# EAGLE design nRF52833_MCU (EAGLE 9.6.2)
Contributed by Nordic Semiconductor Product Page here <http://infocenter.nordicsemi.com/index.jsp?topic=%2Fcom.nordic.infocenter.nrf52832.ps.v1.1%2Fref_circuitry.html> Disclaimer: For the most up to date reference layout see the infocenter at nordicsemi.com Description: Bluetooth Low Energy board

## Sheet 1 of 2
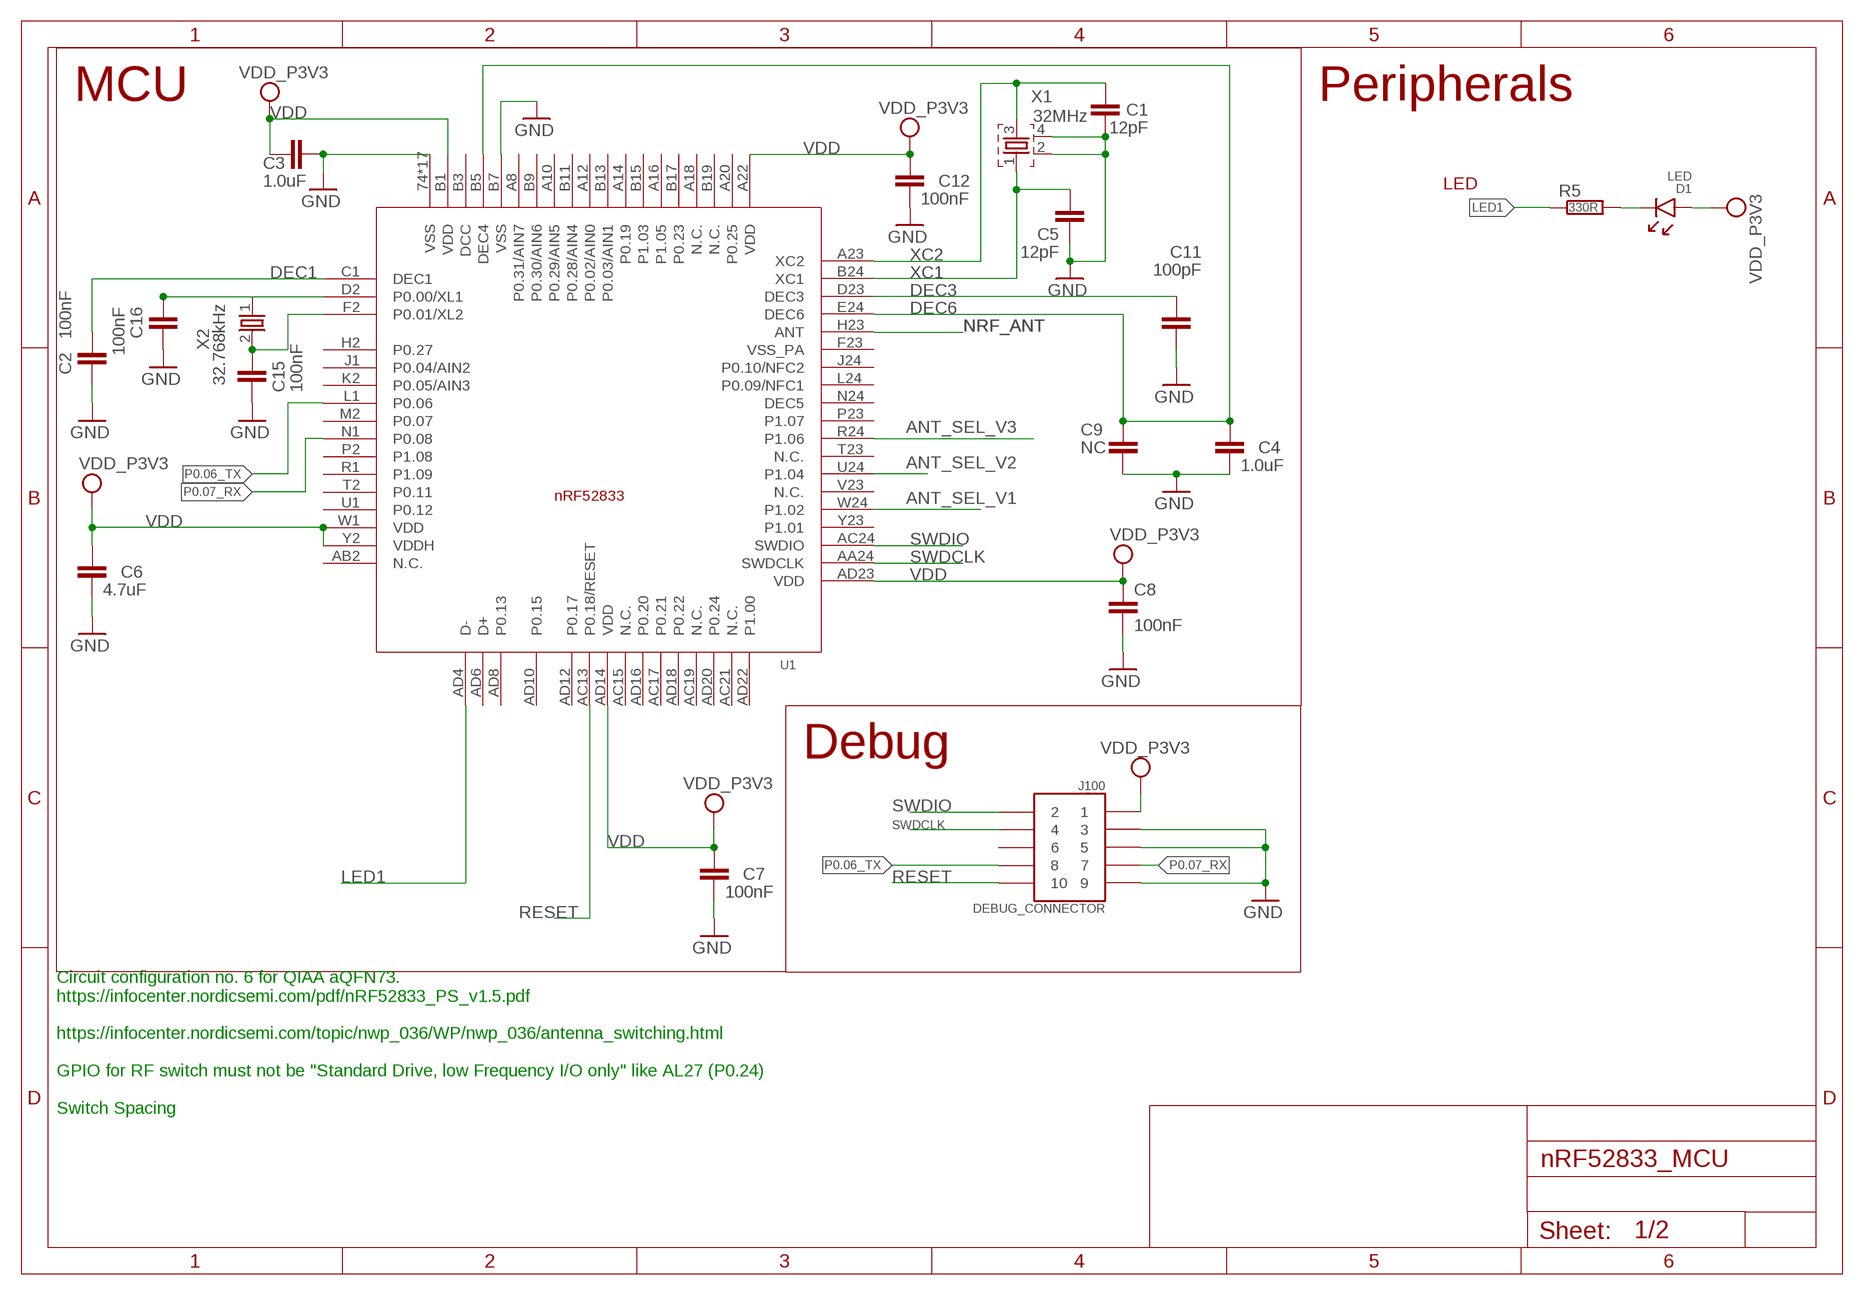
[diagram p0: schematic, sheet 1]

### Parts
C1  12pF  CAPACITOR_0402_N  [RESC0402_N]
C2  100nF  CAPACITOR_0402_N  [RESC0402_N]
C3  1.0uF  CAPACITOR_0402_N  [RESC0402_N]
C4  1.0uF  CAPACITOR_0402_N  [RESC0402_N]
C5  12pF  CAPACITOR_0402_N  [RESC0402_N]
C6  4.7uF  CAPACITOR_0402_N  [RESC0402_N]
C7  100nF  CAPACITOR_0402_N  [RESC0402_N]
C8  100nF  CAPACITOR_0402_N  [RESC0402_N]
C9  NC  CAPACITOR_0402_N  [RESC0402_N]
C11  100pF  CAPACITOR_0402_N  [RESC0402_N]
C12  100nF  CAPACITOR_0402_N  [RESC0402_N]
C15  100nF  CAPACITOR_0402_N  [RESC0402_N]
C16  100nF  CAPACITOR_0402_N  [RESC0402_N]
D1  LED  [DIOC0603_N]
J100  DEBUG_CONNECTOR  [HDRV127P5X2-10_N]
R5  330R  RESISTOR_0402_N  [RESC0402_N]
U1  nRF52833-QIAA  NRF52833_QIAANRF52833_QIAA_AQFN50P700X700X85_HS-74N  [AQFN50P700X700X85_HS-74N]
X1  32MHz  XTAL_32MHZ  [BT-XTAL_2016_N]
X2  32.768kHz  XTAL_32KHZ  [XTAL_3215_N]

### Nets
ANT_SEL_V1: U1.W24(P1.02) ; also sheet 2
ANT_SEL_V2: U1.U24(P1.04) ; also sheet 2
ANT_SEL_V3: U1.R24(P1.06) ; also sheet 2
DEC1: C2.1 U1.C1(DEC1)
DEC3: C11.1 U1.D23(DEC3)
DEC6: C4.1 C9.1 U1.B5(DEC4) U1.E24(DEC6)
GND: C1.2 C2.2 C3.2 C4.2 C5.2 C6.2 C7.2 C8.2 C9.2 C11.2 C12.2 C15.1 C16.1 J100.3 J100.5 J100.9 U1.74(VSS) U1.B7(VSS) U1.P$1(VSS) U1.P$2(VSS) U1.P$3(VSS) U1.P$4(VSS) U1.P$5(VSS) U1.P$10(VSS) U1.P$11(VSS) U1.P$12(VSS) U1.P$13(VSS) U1.P$14(VSS) U1.P$15(VSS) U1.P$16(VSS) U1.P$17(VSS) U1.P$18(VSS) U1.P$19(VSS) U1.P$20(VSS) X1.2 X1.4 ; also sheet 2
LED1: R5.1 U1.AD4(D-)
N$2: C16.2 U1.D2(P0.00/XL1) X2.1
N$3: C15.2 U1.F2(P0.01/XL2) X2.2
N$8: D1.1(C) R5.2
NRF_ANT: U1.H23(ANT) ; also sheet 2
P0.06_TX: J100.8 U1.L1(P0.06)
P0.07_RX: J100.7 U1.N1(P0.08)
RESET: J100.10 U1.AC13(P0.18/RESET)
SWDCLK: J100.4 U1.AA24(SWDCLK)
SWDIO: J100.2 U1.AC24(SWDIO)
VDD: C3.1 C6.1 C7.1 C8.1 C12.1 D1.2(A) J100.1 U1.A22(VDD) U1.AD14(VDD) U1.AD23(VDD) U1.B1(VDD) U1.W1(VDD) U1.Y2(VDDH) ; supply symbol labelled VDD_P3V3 ; also sheet 2
XC1: C5.1 U1.B24(XC1) X1.1
XC2: C1.1 U1.A23(XC2) X1.3
Unconnected: J100.6 U1.A8(P0.31/AIN7) U1.A10(P0.29/AIN5) U1.A12(P0.02/AIN0) U1.A14(P0.19) U1.A16(P1.05) U1.A18(N.C.) U1.A20(P0.25) U1.AB2(N.C.) U1.AC15(N.C.) U1.AC17(P0.21) U1.AC19(N.C.) U1.AC21(N.C.) U1.AD6(D+) U1.AD8(P0.13) U1.AD10(P0.15) U1.AD12(P0.17) U1.AD16(P0.20) U1.AD18(P0.22) U1.AD20(P0.24) U1.AD22(P1.00) U1.B3(DCC) U1.B9(P0.30/AIN6) U1.B11(P0.28/AIN4) U1.B13(P0.03/AIN1) U1.B15(P1.03) U1.B17(P0.23) U1.B19(N.C.) U1.H2(P0.27) U1.J1(P0.04/AIN2) U1.J24(P0.10/NFC2) U1.K2(P0.05/AIN3) U1.L24(P0.09/NFC1) U1.M2(P0.07) U1.P2(P1.08) U1.P23(P1.07) U1.R1(P1.09) U1.T2(P0.11) U1.T23(N.C.) U1.U1(P0.12) U1.V23(N.C.) U1.Y23(P1.01)

### Notes on the sheet
- MCU | Peripherals
- LED
- Debug
- Circuit configuration no. 6 for QIAA aQFN73.
  https://infocenter.nordicsemi.com/pdf/nRF52833_PS_v1.5.pdf
  
  https://infocenter.nordicsemi.com/topic/nwp_036/WP/nwp_036/antenna_switching.html
  
  GPIO for RF switch must not be "Standard Drive, low Frequency I/O only" like AL27 (P0.24)
  
  Switch Spacing

## Sheet 2 of 2
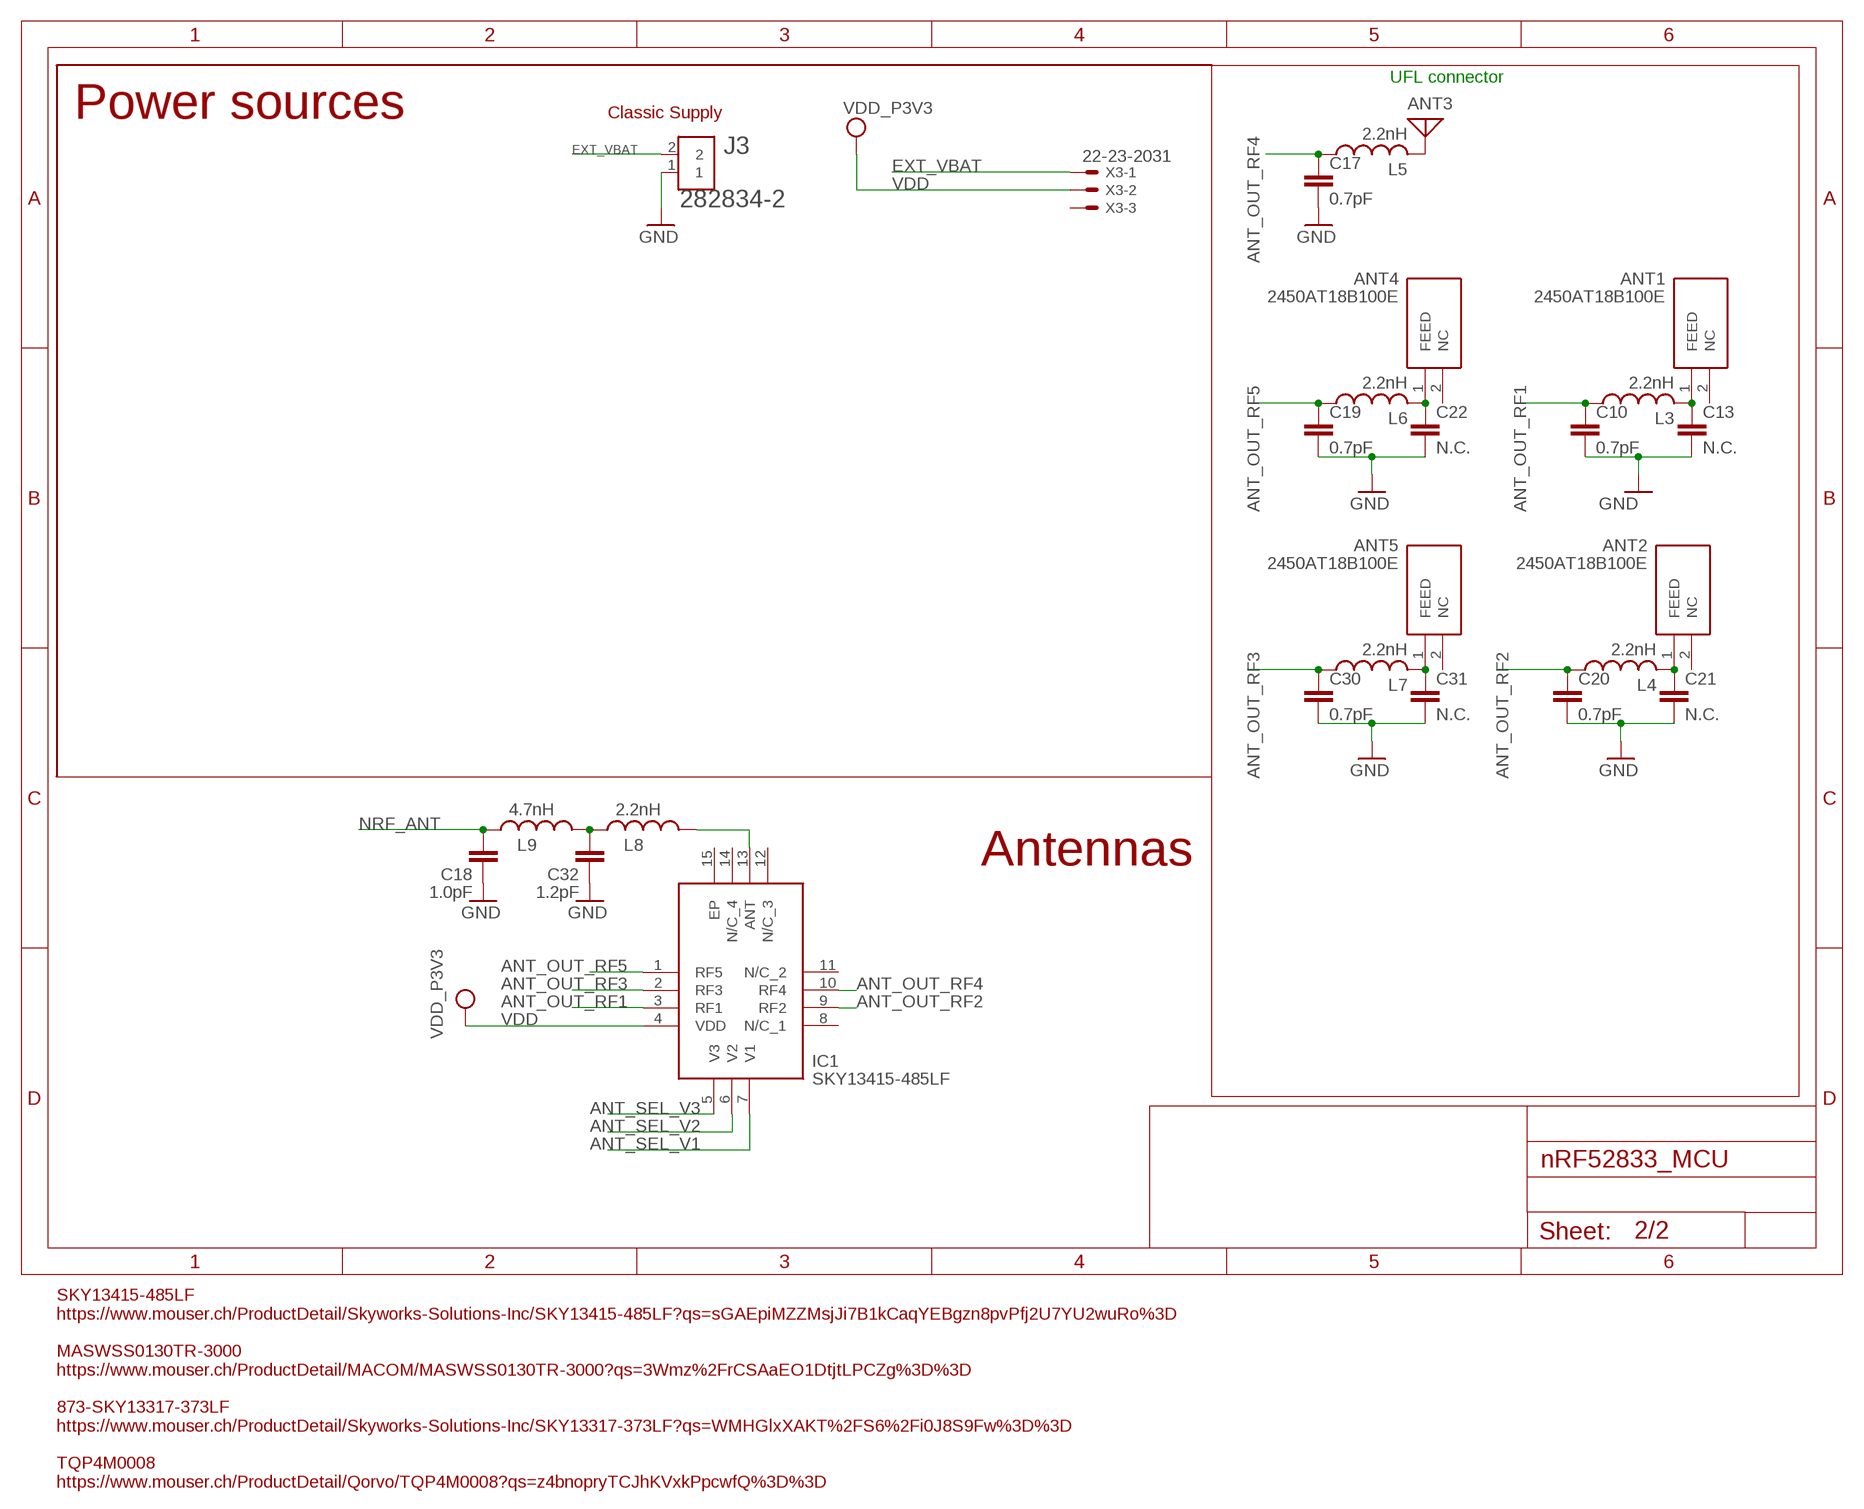
[diagram p1: schematic, sheet 2]

### Parts
ANT1  2450AT18B100E  [ANTC3216X140N]
ANT2  2450AT18B100E  [ANTC3216X140N]
ANT3  ANTENNA  [PAD-01]
ANT4  2450AT18B100E  [ANTC3216X140N]
ANT5  2450AT18B100E  [ANTC3216X140N]
C10  0.7pF  CAPACITOR_0402_N  [RESC0402_N]
C13  N.C.  CAPACITOR_0402_N  [RESC0402_N]
C17  0.7pF  CAPACITOR_0402_N  [RESC0402_N]
C18  1.0pF  CAPACITOR_0402_N  [RESC0402_N]
C19  0.7pF  CAPACITOR_0402_N  [RESC0402_N]
C20  0.7pF  CAPACITOR_0402_N  [RESC0402_N]
C21  N.C.  CAPACITOR_0402_N  [RESC0402_N]
C22  N.C.  CAPACITOR_0402_N  [RESC0402_N]
C30  0.7pF  CAPACITOR_0402_N  [RESC0402_N]
C31  N.C.  CAPACITOR_0402_N  [RESC0402_N]
C32  1.2pF  CAPACITOR_0402_N  [RESC0402_N]
IC1  SKY13415-485LF  [SKY13415485LF]
J3  282834-2  [CONN_282834-2]
L3  2.2nH  INDUCTOR_0402_N  [RESC0402_N]
L4  2.2nH  INDUCTOR_0402_N  [RESC0402_N]
L5  2.2nH  INDUCTOR_0402_N  [RESC0402_N]
L6  2.2nH  INDUCTOR_0402_N  [RESC0402_N]
L7  2.2nH  INDUCTOR_0402_N  [RESC0402_N]
L8  2.2nH  INDUCTOR_0402_N  [RESC0402_N]
L9  4.7nH  INDUCTOR_0402_N  [RESC0402_N]
X3  22-23-2031  [22-23-2031]

### Nets
ANT_OUT_RF1: C10.1 IC1.3(RF1) L3.1
ANT_OUT_RF2: C20.1 IC1.9(RF2) L4.1
ANT_OUT_RF3: C30.1 IC1.2(RF3) L7.1
ANT_OUT_RF4: C17.1 IC1.10(RF4) L5.1
ANT_OUT_RF5: C19.1 IC1.1(RF5) L6.1
ANT_SEL_V1: IC1.7(V1) ; also sheet 1
ANT_SEL_V2: IC1.6(V2) ; also sheet 1
ANT_SEL_V3: IC1.5(V3) ; also sheet 1
EXT_VBAT: J3.2 X3.1
GND: C10.2 C13.2 C17.2 C18.2 C19.2 C20.2 C21.2 C22.2 C30.2 C31.2 C32.2 J3.1 ; also sheet 1
N$5: ANT1.1(FEED) C13.1 L3.2
N$12: ANT3.1 L5.2
N$13: ANT4.1(FEED) C22.1 L6.2
N$14: ANT5.1(FEED) C31.1 L7.2
N$22: IC1.13(ANT) L8.2
N$23: C32.1 L8.1 L9.2
N$40: ANT2.1(FEED) C21.1 L4.2
NRF_ANT: C18.1 L9.1 ; also sheet 1
VDD: IC1.4(VDD) X3.2 ; supply symbol labelled VDD_P3V3 ; also sheet 1
Unconnected: ANT1.2(NC) ANT2.2(NC) ANT4.2(NC) ANT5.2(NC) IC1.8(N/C_1) IC1.11(N/C_2) IC1.12(N/C_3) IC1.14(N/C_4) IC1.15(EP) X3.3

### Notes on the sheet
- UFL connector
- Power sources | Classic Supply
- Antennas
- SKY13415-485LF
  https://www.mouser.ch/ProductDetail/Skyworks-Solutions-Inc/SKY13415-485LF?qs=sGAEpiMZZMsjJi7B1kCaqYEBgzn8pvPfj2U7YU2wuRo%3D
  
  MASWSS0130TR-3000
  https://www.mouser.ch/ProductDetail/MACOM/MASWSS0130TR-3000?qs=3Wmz%2FrCSAaEO1DtjtLPCZg%3D%3D
  
  873-SKY13317-373LF
  https://www.mouser.ch/ProductDetail/Skyworks-Solutions-Inc/SKY13317-373LF?qs=WMHGlxXAKT%2FS6%2Fi0J8S9Fw%3D%3D
  
  TQP4M0008
  https://www.mouser.ch/ProductDetail/Qorvo/TQP4M0008?qs=z4bnopryTCJhKVxkPpcwfQ%3D%3D

## Power pins joined to a net without a drawn wire
DEC5: U1.N24(DEC5)
VSS_PA: U1.F23(VSS_PA)

## Library data of the parts
ANT1 ANT2 ANT4 ANT5 = 2450AT18B100E:2450AT18B100E: Antennas 2.45GHz ANTENNA Source: Datasheet <https://www.johansontechnology.com/datasheets/2450AT18B100/2450AT18B100.pdf>; DESCRIPTION: Antennas 2.45GHz ANTENNA; HEIGHT: 1.4mm; MANUFACTURER_NAME: JOHANSON TECHNOLOGY; MANUFACTURER_PART_NUMBER: 2450AT18B100E; MOUSER_PART_NUMBER: 609-2450AT18B100E; MOUSER_PRICE-STOCK: https://www.mouser.co.uk/ProductDetail/Johanson-Technology/2450AT18B100E?qs=yCnrNFeXz%252Bh5MFsFIXGZGA%3D%3D
ANT3 = discrete:ANTENNA: Antenna
C1-C13 C15-C22 C30-C32 = Nordic_misc:CAPACITOR: Generic chip capacitor
D1 = Nordic_misc:LED
IC1 = SamacSys_Parts:SKY13415-485LF: RF Switch ICs 100-3000MHz SP5T IL .45dB Iso >31dB Source: Datasheet <https://datasheet.datasheetarchive.com/originals/distributors/DKDS-19/379227.pdf>; DESCRIPTION: RF Switch ICs 100-3000MHz SP5T IL .45dB Iso >31dB; HEIGHT: 0.65mm; MANUFACTURER_NAME: Skyworks; MANUFACTURER_PART_NUMBER: SKY13415-485LF; MOUSER_PART_NUMBER: 873-SKY13415-485LF; MOUSER_PRICE-STOCK: https://www.mouser.co.uk/ProductDetail/Skyworks-Solutions-Inc/SKY13415-485LF?qs=aD6bdfC8ElPZ66ZJrc0H4g%3D%3D
J3 = 282834-2:282834-2: Terminal block; 2.54mm; angled 90°; 0.03÷1mm2; ways: 2; 10A; H: 10mm; AVAILABILITY: Unavailable; CENTERLINE_PITCH: 2.54 mm[.1 in]; COMMENT: 282834-2; DESCRIPTION: TERMI-BLOK PCB MOUNT, 90 2P.; EU_ROHS_COMPLIANCE: Compliant with Exemptions; MF: TE Connectivity; MP: 282834-2; NUMBER_OF_POSITIONS: 2; PACKAGE: None; PRICE: None; TE_PURCHASE_URL: https://www.te.com/usa-en/product-282834-2.html?te_bu=Cor&te_type=disp&te_campaign=seda_glo_cor-seda-global-disp-prtnr-fy19-seda-model-bom-cta_sma-317_1&elqCampaignId=32493
J100 = Nordic_misc:DEBUG_CONNECTOR
L3-L9 = Nordic_misc:INDUCTOR: Generic chip inductor
R5 = Nordic_misc:RESISTOR: Generic chip resistor
U1 = nrf52833_qiaa:NRF52833_QIAA: Multi-protocol Bluetooth Low Energy, IEEE 802.15.4, ANT and 2.4GHz proprietary system-on-chip; FOOTPRINT_DOC: AQFN-73; LATESTREVISIONDATE: 2018-12-03; MANUFACTURER: Nordic Semiconductor; MANUFACTURER_PART_NUMBER: nRF52833-QIAA; NOTE: *; PART_NUMBER: nRF52833-QIAA; PIN_COUNT: 73; PUBLISHED: 2018-12-03; PUBLISHER: Nordic Semiconductor
X1 = Nordic_nRF:XTAL_32MHZ
X2 = Nordic_nRF:XTAL_32KHZ
X3 = con-molex:22-23-2031: .100" (2.54mm) Center Header - 3 Pin; MF: MOLEX; MPN: 22-23-2031; OC_FARNELL: 1462950; OC_NEWARK: 30C0862

## Net classes
0 default: clearance 0.205 mm

## Board
Contributed by Nordic Semiconductor Product Page here <http://infocenter.nordicsemi.com/index.jsp?topic=%2Fcom.nordic.infocenter.nrf52832.ps.v1.1%2Fref_circuitry.html> Disclaimer: For the most up to date reference layout see the infocenter at nordicsemi.com Description: Bluetooth Low Energy board
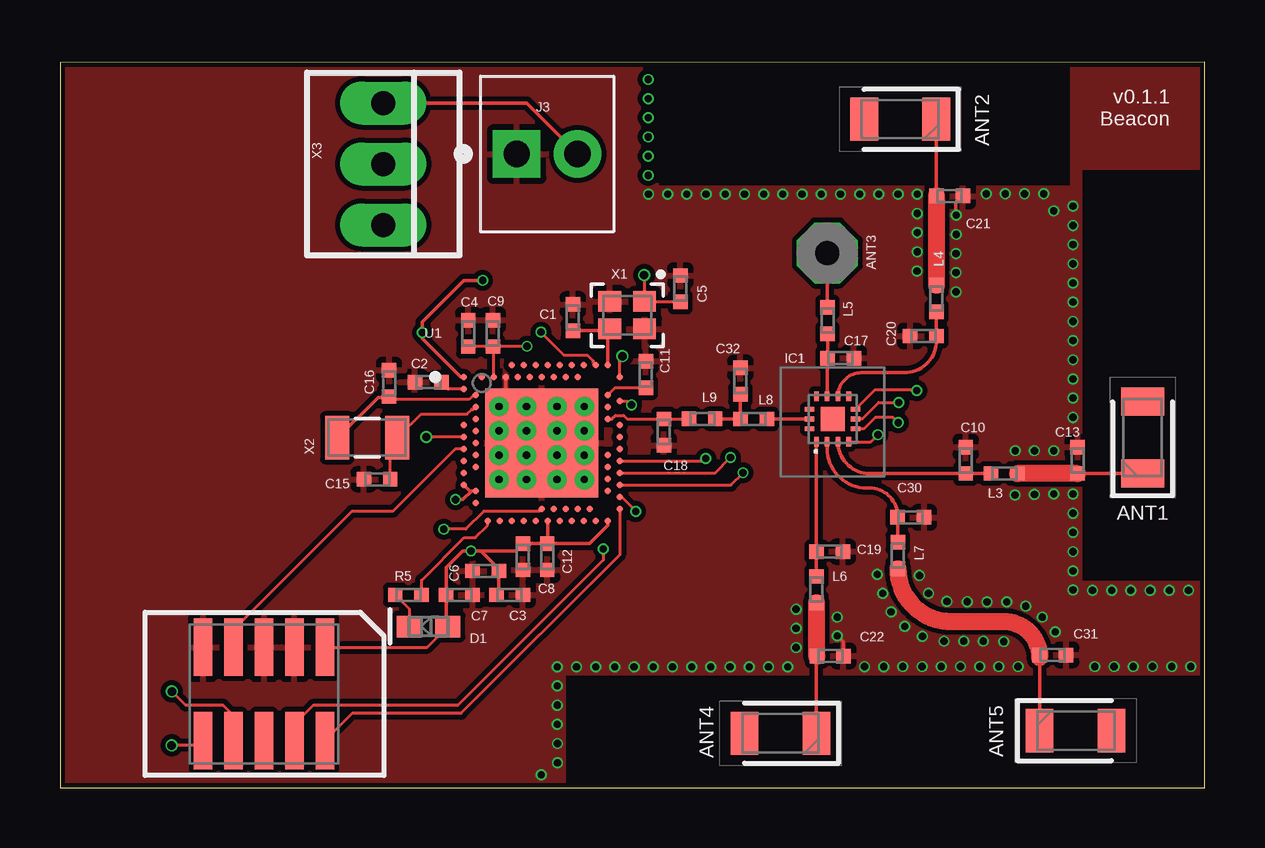
[diagram p2: board, top side]
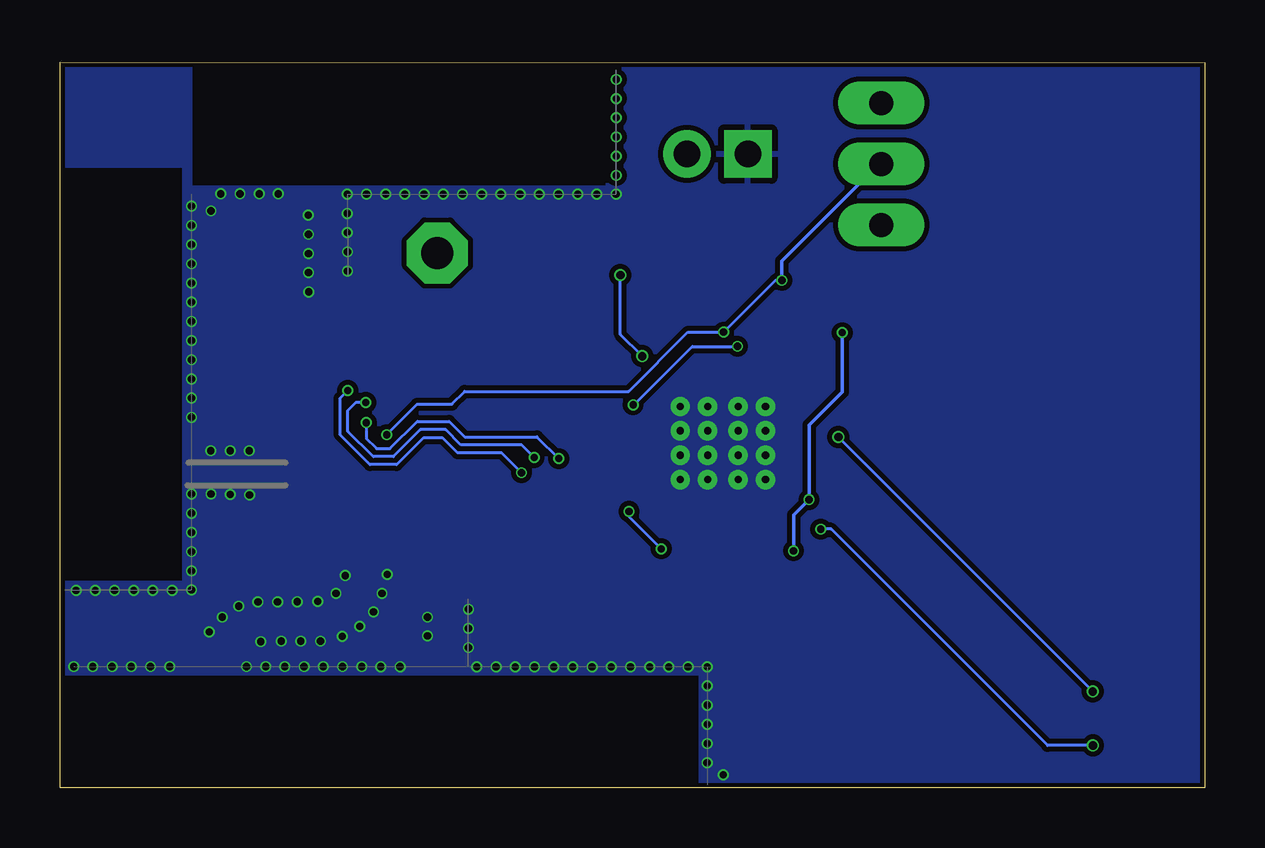
[diagram p3: board, bottom side, seen from below]

Size 47.69 x 30.24 mm. Coordinates in mm from the lower left corner, seen from the top.
Outline: 0,0 47.69,0 47.69,30.24 0,30.22 0,0
Copper layers (1*16): Top 0.035mm / dielectric 1.6mm / Bottom 0.035mm
Design rules "jlcpcb-2layers": minimum track width 5mil, minimum drill 0.3mm, track to track 5mil, track to pad 5mil, pad to pad 5mil, via to via 5mil, smd to smd 5mil, copper to edge 0.2mm, drill to drill 6mil, minimum pad ring 10mil, minimum via ring 3mil, stop-mask expansion 4mil, vias tented up to drill 0mil, thermal gap 10mil
tRestrict: area 42.6,8.6 to 47.6,25.7; area 25,25.1 to 42.1,30.1; area 21.1,-0.3 to 38.2,4.7; area 30.6,-0.3 to 47.7,4.7
bRestrict: area 42.6,8.6 to 47.6,25.8; area 25,25.1 to 42.2,30.1; area 30.5,-0.3 to 47.7,4.7; area 21.1,-0.3 to 38.3,4.7; area 21.1,-0.3 to 38.3,4.7

### Footprints (pad centres in the part's own frame; a part is rotated, then mirrored left to right if it is on the bottom)
ANTC3216X140N = smd 1.15 x 1.8: 1 -1.5,0; 2 1.5,0
PAD-01 = drill 1.321 pad 2.54 octagon: 1 0,0
RESC0402_N = smd 0.6 x 0.6: 1 -0.55,0; 2 0.55,0
DIOC0603_N = smd 1.05 x 0.9: 1 -0.8,0; 2 0.8,0
SKY13415485LF = smd 0.395 x 0.191: 1 -0.953,0.675; 2 -0.953,0.225; 3 -0.953,-0.225; 4 -0.953,-0.675; 8 0.953,-0.675; 9 0.953,-0.225; 10 0.953,0.225; 11 0.953,0.675 | smd 0.191 x 0.395: 5 -0.4,-0.953; 6 0,-0.953; 7 0.4,-0.953; 12 0.4,0.953; 13 0,0.953; 14 -0.4,0.953 | smd 1 x 1: 15 0,0
CONN_282834-2 = drill 1.1 square: 1 -1.27,0 | drill 1.1: 2 1.27,0
HDRV127P5X2-10_N = smd 0.76 x 2.4: 1 -2.54,-1.95; 2 -2.54,1.95; 3 -1.27,-1.95; 4 -1.27,1.95; 5 0,-1.95; 6 0,1.95; 7 1.27,-1.95; 8 1.27,1.95; 9 2.54,-1.95; 10 2.54,1.95
AQFN50P700X700X85_HS-74N = smd 4.699 x 4.547: 74 0,0 | smd 0.275 x 0.275: A8 -1.25,3.25; A10 -0.75,3.25; A12 -0.25,3.25; A14 0.25,3.25; A16 0.75,3.25; A18 1.25,3.25; A20 1.75,3.25; A22 2.25,3.25; A23 2.75,3.25; AA24 3.25,-2.25; AB2 -2.75,-2.5; AC13 0,-2.75; AC15 0.5,-2.75; AC17 1,-2.75; AC19 1.5,-2.75; AC21 2,-2.75; AC24 3.25,-2.75; AD4 -2.25,-3.25; AD6 -1.75,-3.25; AD8 -1.25,-3.25; AD10 -0.75,-3.25; AD12 -0.25,-3.25; AD14 0.25,-3.25; AD16 0.75,-3.25; AD18 1.25,-3.25; AD20 1.75,-3.25; AD22 2.25,-3.25; AD23 2.75,-3.25; B1 -3.25,2.75; B3 -2.5,2.75; B5 -2,2.75; B7 -1.5,2.75; B9 -1,2.75; B11 -0.5,2.75; B13 0,2.75; B15 0.5,2.75; B17 1,2.75; B19 1.5,2.75; B24 3.25,2.75; C1 -3.25,2.25; D2 -2.75,2; D23 2.75,2; E24 3.25,1.75; F2 -2.75,1.5; F23 2.75,1.5; H2 -2.75,1; H23 2.75,1; J1 -3.25,0.75; J24 3.25,0.75; K2 -2.75,0.5; L1 -3.25,0.25; L24 3.25,0.25; M2 -2.75,0; N1 -3.25,-0.25; N24 3.25,-0.25; P2 -2.75,-0.5; P23 2.75,-0.5; R1 -3.25,-0.75; R24 3.25,-0.75; T2 -2.75,-1; T23 2.75,-1; U1 -3.25,-1.25; U24 3.25,-1.25; V23 2.75,-1.5; W1 -3.25,-1.75; W24 3.25,-1.75; Y2 -2.75,-2; Y23 2.75,-2 | drill 0.3 pad 0.406: P$1 -1.778,1.524; P$2 -0.635,-0.508; P$3 -0.635,1.524; P$4 0.635,1.524; P$5 -1.778,-0.508; P$10 -1.778,-1.524; P$11 -0.635,-1.524; P$12 0.635,-1.524; P$13 1.778,-1.524; P$14 0.635,-0.508; P$15 1.778,-0.508; P$16 1.778,1.524; P$17 -1.778,0.508; P$18 -0.635,0.508; P$19 0.635,0.508; P$20 1.778,0.508
BT-XTAL_2016_N = smd 0.95 x 0.85: 1 -0.725,-0.575; 2 0.725,-0.575; 3 0.725,0.575; 4 -0.725,0.575
XTAL_3215_N = smd 1 x 1.8: 1 -1.25,0; 2 1.25,0
22-23-2031 = drill 1 long: 1 -2.54,0; 2 0,0; 3 2.54,0

### Placement (x,y rotation side)
ANT1  45.11,14.6 90 top
ANT2  35.01,27.87 180 top
ANT3  31.97,22.29 0 top
ANT4  30.02,2.27 180 top
ANT5  42.32,2.38 0 top
C1  21.37,19.6 90 top
C2  15.34,16.91 180 top
C3  18.74,8.04 0 top
C4  17.01,18.94 90 top
C5  25.85,20.8 90 top
C6  17.74,9.04 180 top
C7  16.64,8.04 0 top
C8  19.29,9.63 270 top
C9  18.04,18.94 90 top
C10  37.74,13.65 90 top
C11  24.41,17.23 90 top
C12  20.3,9.63 270 top
C13  42.4,13.65 90 top
C15  13.21,12.86 0 top
C16  13.71,16.86 270 top
C17  32.53,17.91 0 top
C18  25.16,14.82 270 top
C19  32.07,9.84 0 top
C20  35.97,18.83 180 top
C21  37.07,24.67 0 top
C22  32.09,5.49 0 top
C30  35.45,11.27 0 top
C31  41.37,5.53 0 top
C32  28.35,16.95 90 top
D1  15.36,6.72 0 top
IC1  32.19,15.37 90 top
J3  20.3,26.42 0 top
J100  8.5,3.91 180 top
L3  39.34,13.1 0 top
L4  36.52,20.39 90 top
L5  31.98,19.48 90 top
L6  31.52,8.26 270 top
L7  34.91,9.68 270 top
L8  28.9,15.37 0 top
L9  26.75,15.38 0 top
R5  14.52,8.04 180 top
U1  20.07,14.37 0 top
X1  23.63,19.7 180 top
X2  12.8,14.59 0 top
X3  13.47,26 270 top

### Tracks (layer width: path | path; a pad name or v marks a point on that pad's centre or on a via)
ANT_OUT_RF1
  Top 0.152: L3.1 C10.1 33.73,13.1 arc-90 IC1.3
ANT_OUT_RF2
  Top 0.152: IC1.9 arc-90 33.39,17.3 35.17,17.3 arc90 36.52,18.65 C20.1 L4.1
ANT_OUT_RF3
  Top 0.152: L7.1 C30.1 34.9,11.33 arc90 33.74,12.49 33.61,12.49 arc-90 31.97,14.14 IC1.2
ANT_OUT_RF4
  Top 0.152: IC1.10 31.97,17.89 C17.1 L5.1
ANT_OUT_RF5
  Top 0.152: L6.1 C19.1 IC1.1
ANT_SEL_V1  (via drill 0.3)
  Top 0.127: v28.46,13.13 27.95,12.62 U1.W24 | IC1.7 33.94,16.57 v35.69,16.57 v35.7,16.56
  Bottom 0.127: v28.46,13.13 29.29,13.96 31.12,13.96 31.75,14.59 32.55,14.59 33.67,13.47 34.77,13.47 36.03,14.73 36.03,16.23 v35.7,16.56
ANT_SEL_V2  (via drill 0.3)
  Top 0.127: U1.U24 27.29,13.12 v27.94,13.76 | IC1.6 33.17,15.4 33.45,15.4 34.11,16.06 v34.95,16.06
  Bottom 0.127: v27.94,13.76 27.94,13.77 28.46,14.3 30.98,14.3 31.62,14.93 32.68,14.93 33.8,13.8 34.64,13.8 35.69,14.86 35.69,15.73 35.35,16.07 34.96,16.07 v34.95,16.06
ANT_SEL_V3  (via drill 0.3)
  Top 0.127: IC1.5 33.51,14.97 33.97,15.43 34.72,15.43 v34.93,15.22 | U1.R24 26.81,13.62 v26.91,13.72
  Bottom 0.127: v34.93,15.22 34.93,14.56 34.5,14.14 33.94,14.14 32.8,15.27 31.47,15.27 30.83,14.63 27.82,14.63 v26.91,13.72
DEC1
  Top 0.127: U1.C1 16.17,16.62 C2.1
DEC3
  Top 0.127: U1.D23 23.13,16.68 C11.1
DEC6  (via drill 0.3)
  Top 0.127: U1.B5 18.07,18.36 C9.1 | C9.1 C4.1 | v19.46,18.4 C9.1 | U1.E24 23.65,16.12 v23.81,15.96
  Top 0.152: U1.B5 | v19.46,18.4
  Bottom 0.127: v23.81,15.96 23.78,15.96 21.34,18.4 v19.46,18.4
EXT_VBAT
  Top 0.152: X3.1 19.45,28.54 J3.2
GND  (via drill 0.3)
  Top 0.152: v37.33,23.88 37.33,24.38 C21.2 | C22.2 32.64,6.07 v32.38,6.33 | C22.2 | U1.B7 18.57,16.17 U1.P$1 | U1.74 20.2,14.37 U1.P$14
  other vias: 32.38,7.11 34.06,8.9 34.28,8.1 34.63,7.33 35.2,6.72 35.93,6.3 36.83,6.11 37.65,6.11 38.47,6.11 39.32,6.09 35.81,8.84 36.19,8.1 36.95,7.76 37.8,7.75 38.62,7.75 39.44,7.74 40.24,7.57 40.92,7.11 41.47,6.49 41.41,14.05 40.6,14.05 41.4,12.24 40.6,12.23 35.72,24.74 34.92,24.74 34.12,24.74 33.32,24.74 32.52,24.74 31.72,24.74 30.92,24.74 30.12,24.74 29.32,24.74 28.52,24.74 27.72,24.74 26.92,24.74 26.12,24.74 25.32,24.74 24.52,24.74 37.34,23.07 37.34,22.27 37.33,21.47 37.33,20.67 41.4,24.05 40.99,24.76 40.19,24.76 39.39,24.76 38.59,24.76 42.21,8.24 42.21,9.04 42.21,9.84 42.21,10.64 42.21,11.44 42.21,12.24 42.21,15.44 42.21,16.24 42.21,17.04 42.21,17.84 42.21,18.64 42.21,19.44 42.21,20.24 42.21,21.04 42.21,21.84 42.21,22.64 42.21,23.44 42.21,24.24 47.12,5.05 46.32,5.05 45.52,5.05 44.72,5.05 43.92,5.05 43.12,5.05 39.92,5.05 39.12,5.05 38.32,5.05 37.52,5.05 36.72,5.05 35.92,5.05 35.12,5.05 34.32,5.05 33.52,5.04 30.32,5.04 29.52,5.04 28.72,5.04 27.92,5.04 27.12,5.04 26.32,5.04 25.52,5.04 24.72,5.04 23.92,5.04 23.12,5.04 22.32,5.04 21.52,5.04 20.72,5.04 20.72,4.24 20.72,3.44 20.72,2.64 20.73,1.84 20.73,1.04 20.05,0.54 30.67,5.84 30.67,6.64 30.67,7.44 43.02,8.23 43.82,8.23 44.62,8.23 45.42,8.23 46.22,8.23 47.02,8.23 35.71,21.54 35.72,23.14 35.71,22.34 35.72,23.94 39.79,12.21 39.8,14.05
  pour Bottom: 0,-0.03 0,30.2 47.66,30.2 47.66,-0.03
  pour Top: 0,-0.03 0,30.2 47.66,30.2 47.66,-0.03
LED1
  Top 0.127: R5.1 15.07,8.65 16.85,10.43 17.31,10.43 17.82,10.94 U1.AD4
N$2
  Top 0.127: U1.D2 17.3,16.35 17.21,16.35 17.05,16.18 13.77,16.18 13.68,16.27
  Top 0.152: X2.1 11.57,14.59 13.25,16.27 13.67,16.27 | 13.68,16.27 13.67,16.27 | C16.2 13.67,16.27
N$3
  Top 0.127: C15.2 13.76,14.3 X2.2 15.05,15.58 16.95,15.58 17.15,15.78 17.23,15.78 U1.F2
N$4  (via drill 0.3)
  other vias: 24.51,25.53
N$5
  Top 0.152: ANT1.1 C13.1
  Top 0.7: C13.1 L3.2 | L3.2
N$6  (via drill 0.3)
  other vias: 24.51,26.33
N$7  (via drill 0.3)
  other vias: 24.51,27.13
N$8
  Top 0.127: R5.2 14.56,7.45 D1.1
N$9  (via drill 0.3)
  other vias: 24.51,27.93
N$10  (via drill 0.3)
  other vias: 24.51,28.73
N$11  (via drill 0.3)
  other vias: 24.51,29.53
N$12
  Top 0.152: ANT3.1 L5.2
N$13
  Top 0.152: ANT4.1 31.52,5.51
  Top 0.7: L6.2 31.52,5.51 C22.1
N$14
  Top 0.152: C31.1 40.82,5.43 ANT5.1
  Top 0.7: L7.2 arc90 37.11,6.93 39.32,6.93 arc-90 40.82,5.43
N$22
  Top 0.152: IC1.13 L8.2
N$23
  Top 0.152: C32.1 L8.1 L9.2
N$40
  Top 0.152: ANT2.1 C21.1
  Top 0.7: C21.1 L4.2
NRF_ANT
  Top 0.127: L9.1 25.25,15.37 | U1.H23 23,15.37 23.15,15.53 23.49,15.53 23.64,15.37 C18.1
  Top 0.152: C18.1 25.25,15.37
P0.06_TX  (via drill 0.35)
  Top 0.127: U1.L1 v15.26,14.62 | v4.66,4.01 5.23,3.44 6.8,3.44 7.29,2.95 7.29,2.02 J100.8
  Bottom 0.127: v15.26,14.62 v4.66,4.02 v4.66,4.01
P0.07_RX
  Top 0.127: U1.N1 16.47,14.12 13.87,11.52 12.16,11.52 7.23,6.59 J100.7
RESET  (via drill 0.3, 0.35)
  Top 0.127: J100.10 5.76,1.76 v4.65,1.76 | U1.AC13 19.98,11.53 17.65,11.53 16.91,10.78 v15.99,10.78
  Bottom 0.127: v15.99,10.78 15.56,10.78 6.54,1.76 v4.65,1.76
SWDCLK  (via drill 0.3)
  Top 0.127: U1.AA24 23.4,12.12 23.98,11.53 v23.98,11.51 | v22.64,9.96 22.64,9.5 16.57,3.43 10.55,3.43 9.77,2.65 J100.4
  Bottom 0.127: v23.98,11.51 23.98,11.3 v22.64,9.96
SWDIO
  Top 0.127: U1.AC24 23.32,9.7 16.7,3.09 12.17,3.09 J100.2
VDD  (via drill 0.3)
  Top 0.127: U1.A22 22.23,17.71 22.23,17.79 21.99,18.03 21,18.03 v20.04,18.99 | J100.1 15.3,5.86 16.13,6.69 16.13,6.75 D1.2 16.09,6.79 | IC1.4 33.78,14.42 v34.08,14.72
  Top 0.152: v17.13,9.88 16.78,9.88 16.09,9.18 C7.1 16.09,6.79 | U1.AD14 20.32,10.2 C12.1 | U1.B1 16.7,17.12 15.1,18.72 v15.1,18.97 15.1,19.42 16.83,21.15 v17.61,21.15 | C3.1 18.29,8.14 C6.1 18.29,9.12 17.54,9.88 v17.13,9.88 | v16.48,12.01 16.79,12.01 17.15,12.37 U1.Y2 17.07,12.37 U1.W1 | v17.13,9.88 v17.13,9.87 18.98,9.87 C8.1 C12.1 | C12.1 22.07,10.18 22.82,10.93 U1.AD23
  Bottom 0.127: v17.61,21.15 17.88,21.15 v20.04,18.99 21.53,18.99 24,16.53 30.83,16.53 31.37,15.99 32.81,15.99 v34.08,14.72
  Bottom 0.152: X3.2 13.57,26 17.61,21.96 v17.61,21.15 | v15.1,18.97 15.1,16.5 16.48,15.13 v16.48,12.01 17.13,11.36 v17.13,9.88
XC1  (via drill 0.35)
  Top 0.127: C5.1 25.83,20.27 X1.1 24.34,20.29 v24.34,21.37 | U1.B24 23.32,17.88 v23.43,17.99
  Bottom 0.127: v23.43,17.99 24.34,18.9 v24.34,21.37
XC2
  Top 0.152: U1.A23 22.82,19.04 22.83,19.05 | X1.3 22.83,19.05 | 22.83,19.05 C1.1

### Text on the board
tNames: v0.1.1 / Beacon